# Altium schematic sheet GTH.SchDoc
size A4; CompanyName: Technische Hochschule Nürnberg Georg Simon Ohm; Organization: UltraZohm; Address1: Kesslerplatz 12; Address2: 90489 Nürnberg; Address3: GERMANY; SheetNumber: 18; Website: www.ultrazohm.com
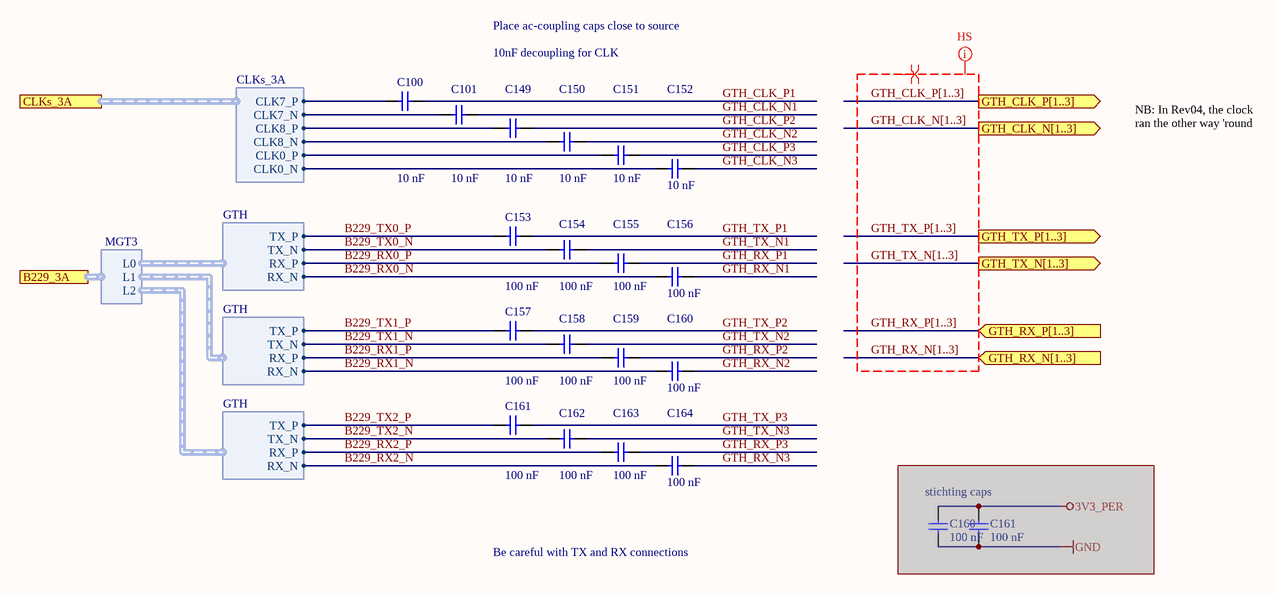
[diagram p0: GTH.SchDoc]

## Parts
(Parts that share a designator on the sheet are numbered #1, #2 ... from top to bottom, then left to right.)
C100  10 nF  [C_0402_TE]
C101  10 nF  [C_0402_TE]
C149  10 nF  [C_0402_TE]
C150  10 nF  [C_0402_TE]
C151  10 nF  [C_0402_TE]
C152  10 nF  [C_0402_TE]
C153  100 nF  [C_0402_TE]
C154  100 nF  [C_0402_TE]
C155  100 nF  [C_0402_TE]
C156  100 nF  [C_0402_TE]
C157  100 nF  [C_0402_TE]
C158  100 nF  [C_0402_TE]
C159  100 nF  [C_0402_TE]
C160#1  100 nF  [C_0402_TE]
C160#2  100 nF  [C_0402_TE]  (masked out: inside a compile mask, not in the netlist)
C161#1  100 nF  [C_0402_TE]
C161#2  100 nF  [C_0402_TE]  (masked out: inside a compile mask, not in the netlist)
C162  100 nF  [C_0402_TE]
C163  100 nF  [C_0402_TE]
C164  100 nF  [C_0402_TE]

## Ports
B229_3A (harness MGT3), CLKs_3A (harness CLKs_3A), GTH_CLK_N[1..3] (out), GTH_CLK_P[1..3] (out), GTH_RX_N[1..3] (in), GTH_RX_P[1..3] (in), GTH_TX_N[1..3] (out), GTH_TX_P[1..3] (out)

## Harnesses
GTH: RX_N, RX_P, TX_N, TX_P
MGT3: L0, L1, L2
CLKs_3A: CLK7_P, CLK7_N, CLK8_P, CLK8_N, CLK0_N, CLK0_P

## Nets
B229_RX0_N: C156.1 ; harness GTH.RX_N
B229_RX0_P: C155.1 ; harness GTH.RX_P
B229_RX1_N: C160#1.1 ; harness GTH.RX_N
B229_RX1_P: C159.1 ; harness GTH.RX_P
B229_RX2_N: C164.1 ; harness GTH.RX_N
B229_RX2_P: C163.1 ; harness GTH.RX_P
B229_TX0_N: C154.1 ; harness GTH.TX_N
B229_TX0_P: C153.1 ; harness GTH.TX_P
B229_TX1_N: C158.1 ; harness GTH.TX_N
B229_TX1_P: C157.1 ; harness GTH.TX_P
B229_TX2_N: C162.1 ; harness GTH.TX_N
B229_TX2_P: C161#1.1 ; harness GTH.TX_P
GTH_CLK_N1: C101.2
GTH_CLK_N2: C150.2
GTH_CLK_N3: C152.2
GTH_CLK_P1: C100.2
GTH_CLK_P2: C149.2
GTH_CLK_P3: C151.2
GTH_RX_N1: C156.2
GTH_RX_N2: C160#1.2
GTH_RX_N3: C164.2
GTH_RX_P1: C155.2
GTH_RX_P2: C159.2
GTH_RX_P3: C163.2
GTH_TX_N1: C154.2
GTH_TX_N2: C158.2
GTH_TX_N3: C162.2
GTH_TX_P1: C153.2
GTH_TX_P2: C157.2
GTH_TX_P3: C161#1.2
NetC100_1: C100.1 ; port CLKs_3A.CLK7_P
NetC101_1: C101.1 ; port CLKs_3A.CLK7_N
NetC149_1: C149.1 ; port CLKs_3A.CLK8_P
NetC150_1: C150.1 ; port CLKs_3A.CLK8_N
NetC151_1: C151.1 ; port CLKs_3A.CLK0_P
NetC152_1: C152.1 ; port CLKs_3A.CLK0_N

## Buses and harness runs
bus GTH_CLK_N[1..3] = port GTH_CLK_N[1..3]
bus GTH_CLK_P[1..3] = port GTH_CLK_P[1..3]
bus GTH_RX_N[1..3] = port GTH_RX_N[1..3]
bus GTH_RX_P[1..3] = port GTH_RX_P[1..3]
bus GTH_TX_N[1..3] = port GTH_TX_N[1..3]
bus GTH_TX_P[1..3] = port GTH_TX_P[1..3]

## Layout directives
differential pair: GTH_CLK_N[1..3], GTH_CLK_P[1..3], GTH_RX_N[1..3], GTH_RX_P[1..3], GTH_TX_N[1..3], GTH_TX_P[1..3]
net class HS: GTH_CLK_N[1..3], GTH_CLK_P[1..3], GTH_RX_N[1..3], GTH_RX_P[1..3], GTH_TX_N[1..3], GTH_TX_P[1..3]

## Notes on the sheet
- Place ac-coupling caps close to source
- 10nF decoupling for CLK
- NB: In Rev04, the clock ran the other way 'round
- stichting caps
- Be careful with TX and RX connections
- Title
- Revision:
- Design Engineer:
- Date:
- Project:
- Sheet
- of

## Library data of the parts
C100 C101 C149-C152 = UZgen_C_0402_10nF_16V_X7R: Generic capacitor; Manufacturer: UZgen; Voltage: 16V; Tolerance: 10 %; Created from: UZgenTool; Technology: X7R; Value: 10 nF; Manufacturer Part Number: UZgen_C_0402_10nF_16V_X7R; PartID: 2900; Created On: 02/08/2024 11:17:39; Device Package: 0402; Mounting Type: SMD; Last Updated: 02/08/2024 11:17:39
C153-C159 C160#1 C160#2 C161#1 C161#2 C162-C164 = UZgen_C_0402_100nF_50V_X7R: Generic capacitor; Manufacturer: UZgen; Voltage: 50V; Tolerance: 10 %; Created from: UZgenTool; Technology: X7R; Value: 100 nF; Manufacturer Part Number: UZgen_C_0402_100nF_50V_X7R; PartID: 3431; Created On: 02/08/2024 11:17:51; Device Package: 0402; Mounting Type: SMD; Last Updated: 02/08/2024 11:17:51